# Altium schematic sheet Coil_switch.SchDoc
size A3
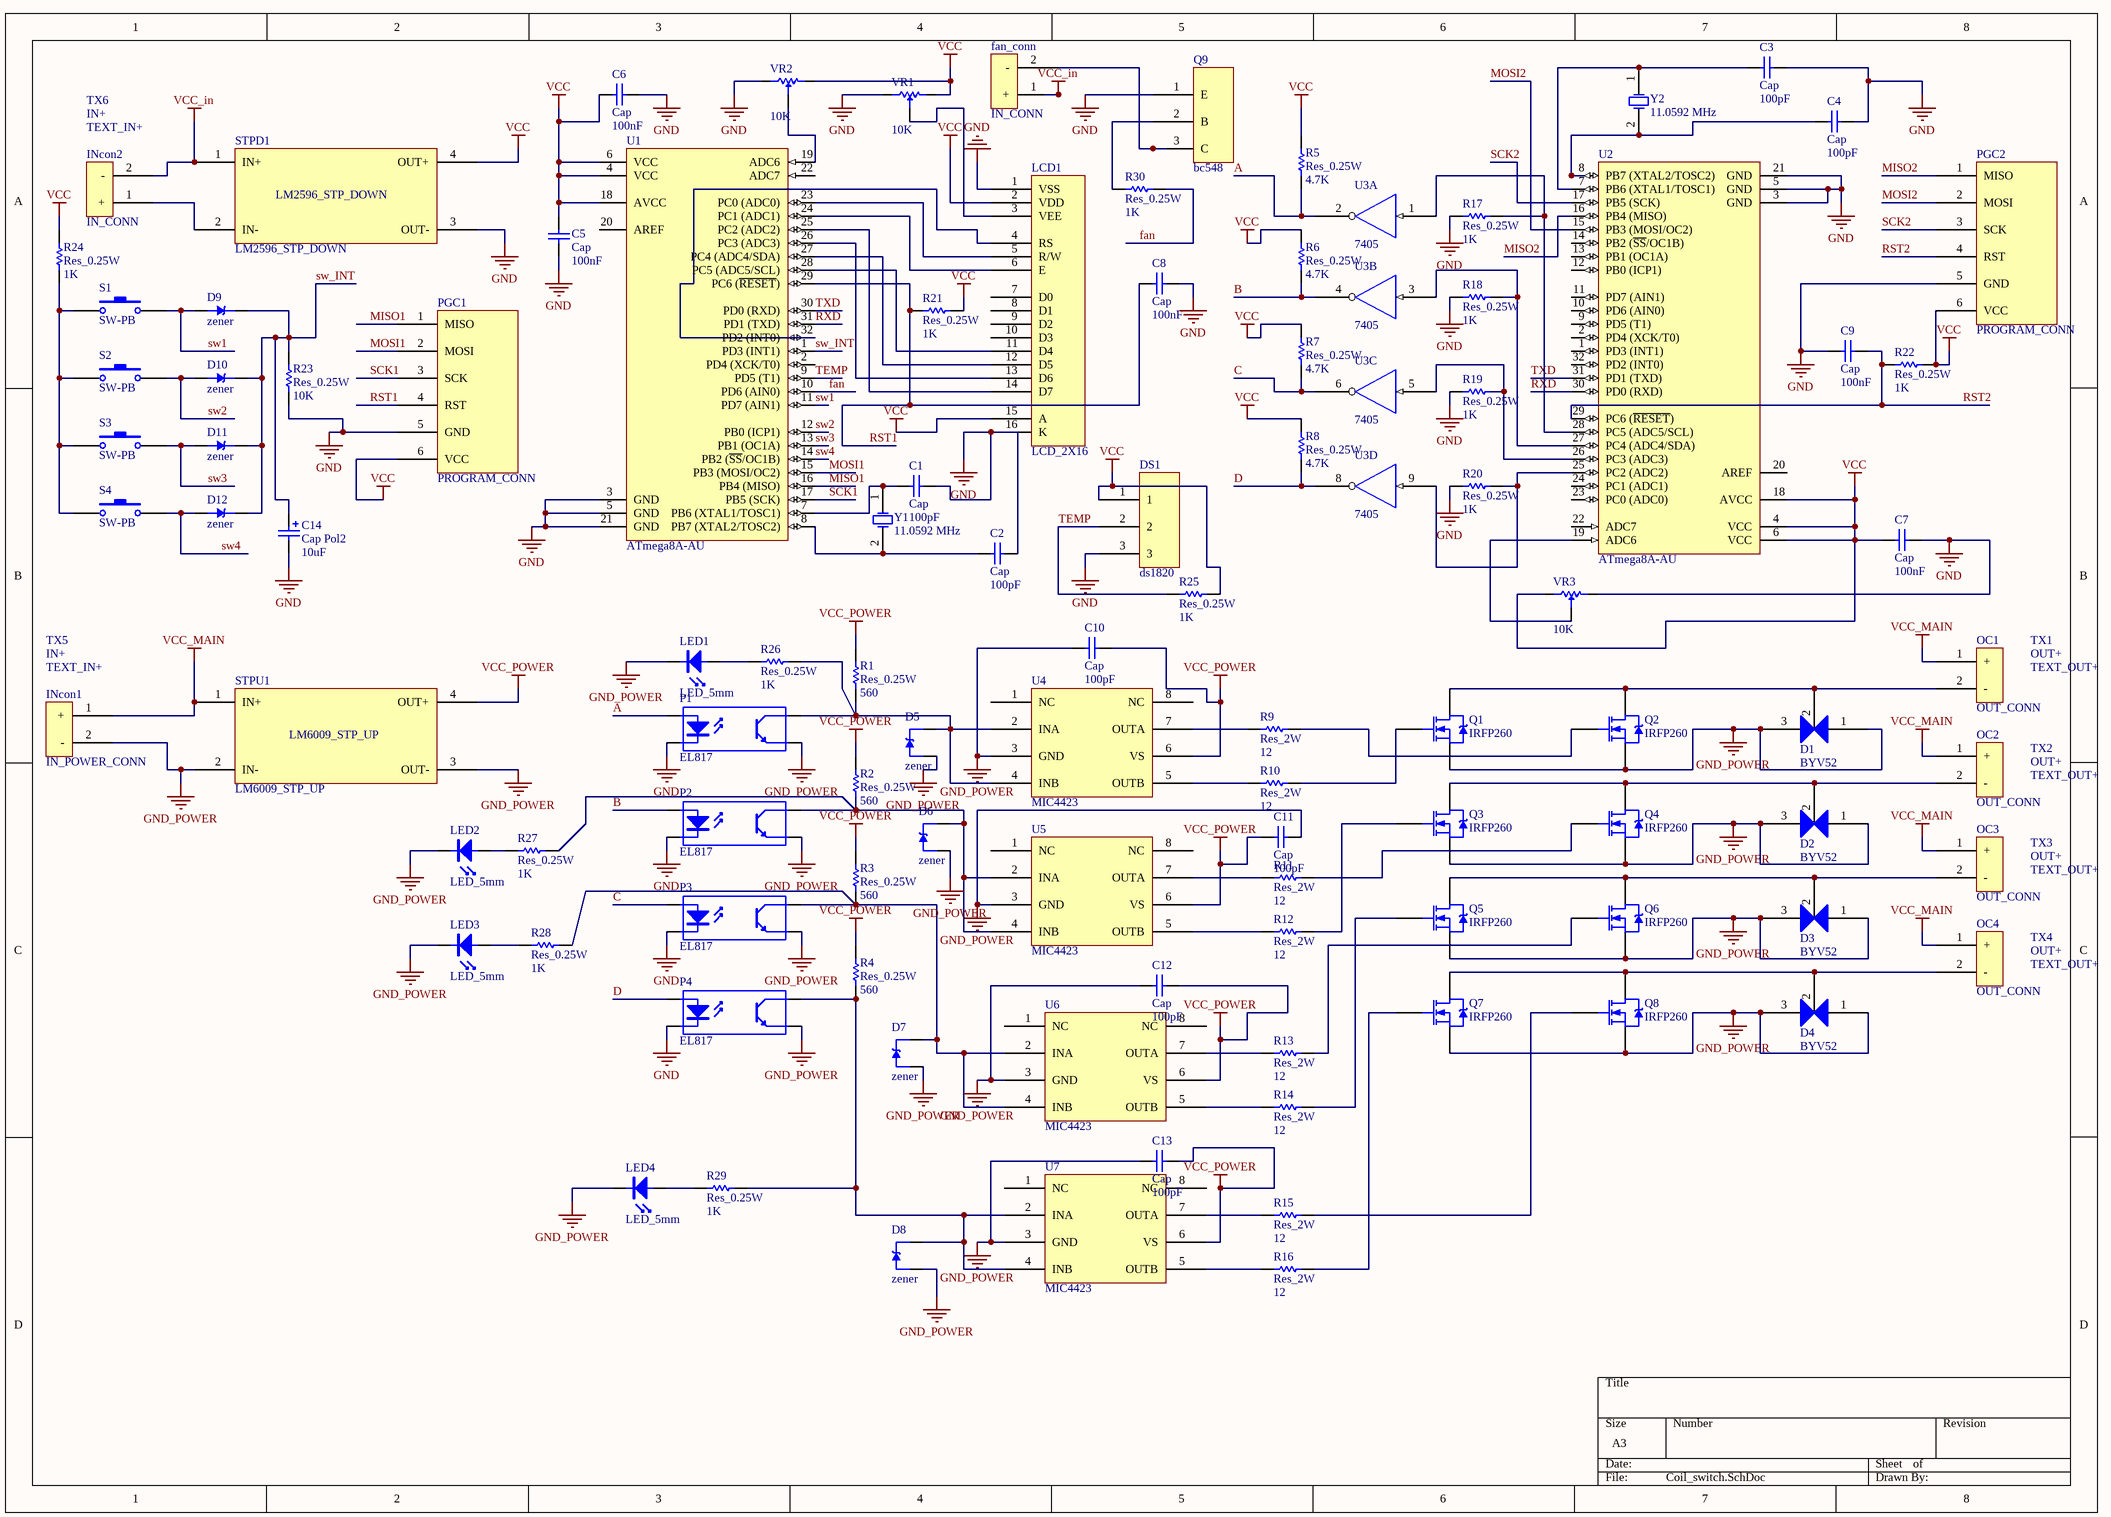
[diagram p0: Coil_switch.SchDoc]

## Parts
C1  Cap  value 100pF  [RAD-0.2]
C2  Cap  value 100pF  [RAD-0.2]
C3  Cap  value 100pF  [RAD-0.2]
C4  Cap  value 100pF  [RAD-0.2]
C5  Cap  value 100nF  [RAD-0.2]
C6  Cap  value 100nF  [RAD-0.2]
C7  Cap  value 100nF  [RAD-0.2]
C8  Cap  value 100nF  [RAD-0.2]
C9  Cap  value 100nF  [RAD-0.2]
C10  Cap  value 100pF  [RAD-0.2]
C11  Cap  value 100pF  [RAD-0.2]
C12  Cap  value 100pF  [RAD-0.2]
C13  Cap  value 100pF  [RAD-0.2]
C14  Cap Pol2  value 10uF  [RB5-10.5]
D1  BYV52  [TO-247AC]
D2  BYV52  [TO-247AC]
D3  BYV52  [TO-247AC]
D4  BYV52  [TO-247AC]
D5  zener  [AXIAL-0.3_z]
D6  zener  [AXIAL-0.3_z]
D7  zener  [AXIAL-0.3_z]
D8  zener  [AXIAL-0.3_z]
D9  zener  [AXIAL-0.3_z]
D10  zener  [AXIAL-0.3_z]
D11  zener  [AXIAL-0.3_z]
D12  zener  [AXIAL-0.3_z]
DS1  ds1820  [multi_turn]
fan_conn  IN_CONN  [in_conn]
INcon1  IN_POWER_CONN  [IN_POWER_CONN]
INcon2  IN_CONN  [in_conn]
LCD1  LCD_2X16  [LCD 16x2-A]
LED1  LED_5mm  [led5mm]
LED2  LED_5mm  [led5mm]
LED3  LED_5mm  [led5mm]
LED4  LED_5mm  [led5mm]
OC1  OUT_CONN  [out_conn]
OC2  OUT_CONN  [out_conn]
OC3  OUT_CONN  [out_conn]
OC4  OUT_CONN  [out_conn]
P1  EL817  [EL817_SMD_S2]
P2  EL817  [EL817_SMD_S2]
P3  EL817  [EL817_SMD_S2]
P4  EL817  [EL817_SMD_S2]
PGC1  PROGRAM_CONN  [PROGRAM_CONN]
PGC2  PROGRAM_CONN  [PROGRAM_CONN]
Q1  IRFP260  [TO-247AC]
Q2  IRFP260  [TO-247AC]
Q3  IRFP260  [TO-247AC]
Q4  IRFP260  [TO-247AC]
Q5  IRFP260  [TO-247AC]
Q6  IRFP260  [TO-247AC]
Q7  IRFP260  [TO-247AC]
Q8  IRFP260  [TO-247AC]
Q9  bc548  [multi_turn]
R1  Res_0.25W  value 560  [AXIAL-0.3]
R2  Res_0.25W  value 560  [AXIAL-0.3]
R3  Res_0.25W  value 560  [AXIAL-0.3]
R4  Res_0.25W  value 560  [AXIAL-0.3]
R5  Res_0.25W  value 4.7K  [AXIAL-0.3]
R6  Res_0.25W  value 4.7K  [AXIAL-0.3]
R7  Res_0.25W  value 4.7K  [AXIAL-0.3]
R8  Res_0.25W  value 4.7K  [AXIAL-0.3]
R9  Res_2W  value 12  [AXIAL-0.6]
R10  Res_2W  value 12  [AXIAL-0.6]
R11  Res_2W  value 12  [AXIAL-0.6]
R12  Res_2W  value 12  [AXIAL-0.6]
R13  Res_2W  value 12  [AXIAL-0.6]
R14  Res_2W  value 12  [AXIAL-0.6]
R15  Res_2W  value 12  [AXIAL-0.6]
R16  Res_2W  value 12  [AXIAL-0.6]
R17  Res_0.25W  value 1K  [AXIAL-0.3]
R18  Res_0.25W  value 1K  [AXIAL-0.3]
R19  Res_0.25W  value 1K  [AXIAL-0.3]
R20  Res_0.25W  value 1K  [AXIAL-0.3]
R21  Res_0.25W  value 1K  [AXIAL-0.3]
R22  Res_0.25W  value 1K  [AXIAL-0.3]
R23  Res_0.25W  value 10K  [AXIAL-0.3]
R24  Res_0.25W  value 1K  [AXIAL-0.3]
R25  Res_0.25W  value 1K  [AXIAL-0.3]
R26  Res_0.25W  value 1K  [AXIAL-0.3]
R27  Res_0.25W  value 1K  [AXIAL-0.3]
R28  Res_0.25W  value 1K  [AXIAL-0.3]
R29  Res_0.25W  value 1K  [AXIAL-0.3]
R30  Res_0.25W  value 1K  [AXIAL-0.3]
S1  SW-PB  [PUSH_BUTTON]
S2  SW-PB  [PUSH_BUTTON]
S3  SW-PB  [PUSH_BUTTON]
S4  SW-PB  [PUSH_BUTTON]
STPD1  LM2596_STP_DOWN  [POWER_SWITCHING]
STPU1  LM6009_STP_UP  [POWER_SWITCHING]
TX1  TEXT_OUT+  [TEXT_OUT+]
TX2  TEXT_OUT+  [TEXT_OUT+]
TX3  TEXT_OUT+  [TEXT_OUT+]
TX4  TEXT_OUT+  [TEXT_OUT+]
TX5  TEXT_IN+  [TEXT_in+]
TX6  TEXT_IN+  [TEXT_in+]
U1  ATmega8A-AU  [32A_N]
U2  ATmega8A-AU  [32A_N]
U3  7405  [DIP-14]  (parts A,B,C,D of 6)
U4  MIC4423  [8p3]
U5  MIC4423  [8p3]
U6  MIC4423  [8p3]
U7  MIC4423  [8p3]
VR1  10K  [Multi Turn 02]
VR2  10K  [Multi Turn 02]
VR3  10K  [Multi Turn 02]
Y1  11.0592 MHz  [CRYSTALL]
Y2  11.0592 MHz  [CRYSTALL]

## Nets
GND: C1.2 C2.2 C3.2 C4.2 C5.2 C6.2 C7.2 C8.2 C9.1 C14.2 DS1.3 LCD1.1(VSS) LCD1.16(K) P1.2(K) P2.2(K) P3.2(K) P4.2(K) PGC1.5(GND) PGC2.5(GND) Q9.1(E) R17.1 R18.1 R19.1 R20.1 R23.1 STPD1.3(OUT-) U1.3(GND) U1.5(GND) U1.21(GND) U2.3(GND) U2.5(GND) U2.21(GND) U3.7(GND) VR1.1(CCW) VR2.1(CCW) VR3.2(CW)
GND_POWER: C10.1 C11.2 C12.1 C13.1 D1.1 D1.3 D2.1 D2.3 D3.1 D3.3 D4.1 D4.3 D5.1(A) D6.1(A) D7.1(A) D8.1(A) INcon1.2(-) LED1.2(K) LED2.2(K) LED3.2(K) LED4.2(K) P1.3(E) P2.3(E) P3.3(E) P4.3(E) Q1.3(S) Q2.3(S) Q3.3(S) Q4.3(S) Q5.3(S) Q6.3(S) Q7.3(S) Q8.3(S) STPU1.2(IN-) STPU1.3(OUT-) U4.3(GND) U5.3(GND) U6.3(GND) U7.3(GND)
VCC: C5.1 C6.1 C7.1 DS1.1 LCD1.2(VDD) LCD1.15(A) PGC1.6(VCC) PGC2.6(VCC) R5.1 R6.1 R7.1 R8.1 R21.2 R22.2 R24.2 R25.2 STPD1.4(OUT+) U1.4(VCC) U1.6(VCC) U1.18(AVCC) U2.4(VCC) U2.6(VCC) U2.18(AVCC) U3.14(VCC) VR1.2(CW) VR2.2(CW) VR3.1(CCW)
VCC_in: fan_conn.1(+) INcon2.2(-) STPD1.1(IN+)
VCC_MAIN: INcon1.1(+) OC1.1(+) OC2.1(+) OC3.1(+) OC4.1(+) STPU1.1(IN+)
VCC_POWER: C10.2 C11.1 C12.2 C13.2 R1.2 R2.2 R3.2 R4.2 STPU1.4(OUT+) U4.6(VS) U5.6(VS) U6.6(VS) U7.6(VS)
A: P1.1(A) R5.2 U3.2
B: P2.1(A) R6.2 U3.4
C: P3.1(A) R7.2 U3.6
D: P4.1(A) R8.2 U3.8
fan: R30.2 U1.10(PD6_(AIN0))
MISO1: PGC1.1(MISO) U1.16(PB4_(MISO))
MISO2: PGC2.1(MISO) U2.16(PB4_(MISO))
MOSI1: PGC1.2(MOSI) U1.15(PB3_(MOSI/OC2))
MOSI2: PGC2.2(MOSI) U2.15(PB3_(MOSI/OC2))
RST1: C8.1 PGC1.4(RST) R21.1 U1.29(PC6_(~{RESET}))
RST2: C9.2 PGC2.4(RST) R22.1 U2.29(PC6_(~{RESET}))
RXD: U1.31(PD1_(TXD)) U2.30(PD0_(RXD))
SCK1: PGC1.3(SCK) U1.17(PB5_(SCK))
SCK2: PGC2.3(SCK) U2.17(PB5_(SCK))
sw1: D9.1(A) S1.2,3 U1.11(PD7_(AIN1))
sw2: D10.1(A) S2.2,3 U1.12(PB0_(ICP1))
sw3: D11.1(A) S3.2,3 U1.13(PB1_(OC1A))
sw4: D12.1(A) S4.2,3 U1.14(PB2_(~{SS}/OC1B))
sw_INT: C14.1 D9.2(K) D10.2(K) D11.2(K) D12.2(K) R23.2 U1.1(PD3_(INT1))
TEMP: DS1.2 R25.1 U1.9(PD5_(T1))
TXD: U1.30(PD0_(RXD)) U2.31(PD1_(TXD))
NetC1_1: C1.1 U1.7(PB6_(XTAL1/TOSC1)) Y1.1(OSC1)
NetC2_1: C2.1 U1.8(PB7_(XTAL2/TOSC2)) Y1.2(OSC2)
NetC3_1: C3.1 U2.7(PB6_(XTAL1/TOSC1)) Y2.1(OSC1)
NetC4_1: C4.1 U2.8(PB7_(XTAL2/TOSC2)) Y2.2(OSC2)
NetD1_2: D1.2 OC1.2(-) Q1.2(D) Q2.2(D)
NetD2_2: D2.2 OC2.2(-) Q3.2(D) Q4.2(D)
NetD3_2: D3.2 OC3.2(-) Q5.2(D) Q6.2(D)
NetD4_2: D4.2 OC4.2(-) Q7.2(D) Q8.2(D)
NetD5_2: D5.2(K) P1.4(C) R1.1 R26.2 U4.2(INA) U4.4(INB)
NetD6_2: D6.2(K) P2.4(C) R2.1 R27.1 U5.2(INA) U5.4(INB)
NetD7_2: D7.2(K) P3.4(C) R3.1 R28.2 U6.2(INA) U6.4(INB)
NetD8_2: D8.2(K) P4.4(C) R4.1 R29.2 U7.2(INA) U7.4(INB)
Netfan_conn_2: fan_conn.2(-) Q9.3(C)
NetINcon2_1: INcon2.1(+) STPD1.2(IN-)
NetLCD1_3: LCD1.3(VEE) VR1.3(Setpoint)
NetLCD1_4: LCD1.4(RS) U1.32(PD2_(INT0))
NetLCD1_5: LCD1.5(R/W) U1.23(PC0_(ADC0))
NetLCD1_6: LCD1.6(E) U1.24(PC1_(ADC1))
NetLCD1_11: LCD1.11(D4) U1.28(PC5_(ADC5/SCL))
NetLCD1_12: LCD1.12(D5) U1.27(PC4_(ADC4/SDA))
NetLCD1_13: LCD1.13(D6) U1.26(PC3_(ADC3))
NetLCD1_14: LCD1.14(D7) U1.25(PC2_(ADC2))
NetLED1_1: LED1.1(A) R26.1
NetLED2_1: LED2.1(A) R27.2
NetLED3_1: LED3.1(A) R28.1
NetLED4_1: LED4.1(A) R29.1
NetQ1_1: Q1.1(G) R10.2
NetQ2_1: Q2.1(G) R9.2
NetQ3_1: Q3.1(G) R12.2
NetQ4_1: Q4.1(G) R11.2
NetQ5_1: Q5.1(G) R14.2
NetQ6_1: Q6.1(G) R13.2
NetQ7_1: Q7.1(G) R16.2
NetQ8_1: Q8.1(G) R15.2
NetQ9_2: Q9.2(B) R30.1
NetR9_1: R9.1 U4.7(OUTA)
NetR10_1: R10.1 U4.5(OUTB)
NetR11_1: R11.1 U5.7(OUTA)
NetR12_1: R12.1 U5.5(OUTB)
NetR13_1: R13.1 U6.7(OUTA)
NetR14_1: R14.1 U6.5(OUTB)
NetR15_1: R15.1 U7.7(OUTA)
NetR16_1: R16.1 U7.5(OUTB)
NetR17_2: R17.2 U2.28(PC5_(ADC5/SCL)) U3.1
NetR18_2: R18.2 U2.27(PC4_(ADC4/SDA)) U3.3
NetR19_2: R19.2 U2.26(PC3_(ADC3)) U3.5
NetR20_2: R20.2 U2.25(PC2_(ADC2)) U3.9
NetR24_1: R24.1 S1.1,4 S2.1,4 S3.1,4 S4.1,4
NetU1_19: U1.19(ADC6) VR2.3(Setpoint)
NetU2_19: U2.19(ADC6) VR3.3(Setpoint)

Not connected (* = marked no-connect by the designer): LCD1 7(D0) 8(D1) 9(D2) 10(D3); U1 2(PD4_(XCK/T0)) 20(AREF) 22(ADC7); U2 1(PD3_(INT1)) 2(PD4_(XCK/T0)) 9(PD5_(T1)) 10(PD6_(AIN0)) 11(PD7_(AIN1)) 12(PB0_(ICP1)) 13(PB1_(OC1A)) 14(PB2_(~{SS}/OC1B)) 20(AREF) 22(ADC7) 23(PC0_(ADC0)) 24(PC1_(ADC1)) 32(PD2_(INT0)); U4 1(NC) 8(NC); U5 1(NC) 8(NC); U6 1(NC) 8(NC); U7 1(NC) 8(NC)

## Notes on the sheet
- (in symbol TEXT_IN+) IN+
- (in symbol TEXT_OUT+) OUT+

## Library data of the parts
C1-C13 = Cap: Capacitor; Published: 8-Jun-2000; LatestRevisionDate: 17-Jul-2002; LatestRevisionNote: Re-released for DXP Platform.; PackageReference: RAD-0.3; Publisher: Altium Limited; PackageDescription: Radial Cap, Thru-Hole; 2 Leads; 0.3 in Pin Spacing
C14 = Cap Pol2: Polarized Capacitor (Radial); Published: 8-Jun-2000; LatestRevisionDate: 17-Jul-2002; LatestRevisionNote: Re-released for DXP Platform.; PackageReference: RB7.6-15; Publisher: Altium Limited; PackageDescription: Polarized Capacitor (Radial); 2 Leads
D1-D4 = BYV52: IGH EFFICIENCY FAST RECOVERY RECTIFIER DIODES
D5-D12 = zener: 2 PIN DIP
LED1-LED4 = LED_5mm: 4 PIN DIP
P1-P4 = EL817: 4 PIN DIP PHOTOTRANSISTOR PHOTOCOUPLER  EL817 Series
Q1-Q8 = IRFP260: HEXFET Power MOSFET
R1-R8 R17-R30 = Res_0.25W: Resistor; Published: 8-Jun-2000; LatestRevisionDate: 17-Jul-2002; LatestRevisionNote: Re-released for DXP Platform.; PackageReference: AXIAL-0.3; Publisher: Altium Limited; PackageDescription: Axial Device, Thru-Hole; 2 Leads; 0.3 in Pin Spacing
R9-R16 = Res_2W: Resistor; Published: 8-Jun-2000; LatestRevisionDate: 17-Jul-2002; LatestRevisionNote: Re-released for DXP Platform.; PackageReference: AXIAL-0.3; Publisher: Altium Limited; PackageDescription: Axial Device, Thru-Hole; 2 Leads; 0.3 in Pin Spacing
S1-S4 = SW-PB: Switch; Published: 24-Mar-1999; LatestRevisionDate: 17-Jul-2002; LatestRevisionNote: Re-released for DXP Platform.; PackageReference: SPST-2; Publisher: Altium Limited; PackageDescription: Switch; 2 Leads
U1 U2 = ATmega8A-AU: 8-bit AVR Microcontroller, 8KB Flash, 512 Bytes EEPROM, 1KB SRAM, 32-pin TQFP, Industrial Grade (-40°C to 85°C); Published: 1-Apr-2010; DatasheetVersion: revC, Jul-2009; PackageVersion: revB, Oct-2001; PackageReference: 32A; Publisher: Altium Limited; PackageDescription: 32-Lead, 7x7x1.0 mm Body, 0.8mm Lead Pitch, Thin Profile Plastic Quad Flat Package (TQFP); Supplier 1: Digi-Key; Supplier Part Number 1: ATMEGA8A-AU-ND; Supplier 2: Farnell; Supplier Part Number 2: 1748532; Supplier 3: Mouser; Supplier Part Number 3: 556-ATMEGA8A-AU; Code_JEDEC: MS-026-ABA; ComponentLink1Description: Manufacturer Link; ComponentLink1URL: http://www.atmel.com/products/avr/default.asp?; ComponentLink2Description: ATmega8A Datasheet; ComponentLink2URL: http://www.atmel.com/dyn/resources/prod_documents/doc8159.pdf; ComponentLink3Description: ATmega8A Summary; ComponentLink3URL: http://www.atmel.com/dyn/resources/prod_documents/8159S.pdf; ComponentLink4Description: Atmel.com Home; ComponentLink4URL: http://www.atmel.com
VR1-VR3 = Resistor Variable: Variable Resistor; Designer: Saeid Jorablo; Company: ControTec; Adding Date: 137/12/22; Value: 10K
Y1 Y2 = XTAL: XTAL Crystal; Company: E.P.I.L; Design Date: 11/04/2011; Value: 11.0592 MHz